# Altium project Ultimaker.PrjPcb (part 2 of 2)

## Sheet schema4.SchDoc
size A3; ApprovedBy: CdB; CheckedBy: CdB; DrawnBy: RT; Engineer: CdB; Organization: Faber Electronics B.V.; Address1: Th. Dobbeweg 1,; Address2: 6883 GN Velp,; Address3: Netherlands; Address4: T: 026-38 46 800; DocumentNumber: 4; Revision: 2.1.4; SheetNumber: 4; SheetTotal: 6; Status: Final; PageSetup: Record=PageOptions|CenterHorizontal=True|CenterVertical=True|PrintScale=1.01|XCorrection=1.00|YCorrection=1.00|PrintKind=1|BorderSize=5000000|LeftOffset=0|BottomOffset=0|Orientation=2|PaperLength=1000|PaperWidth=1000|Scale=100|PaperSource=7|PrintQuality=1200|MediaType=1|DitherType=10|PaperKind=A3 (297 x 420mm)|PrintScaleMode=1
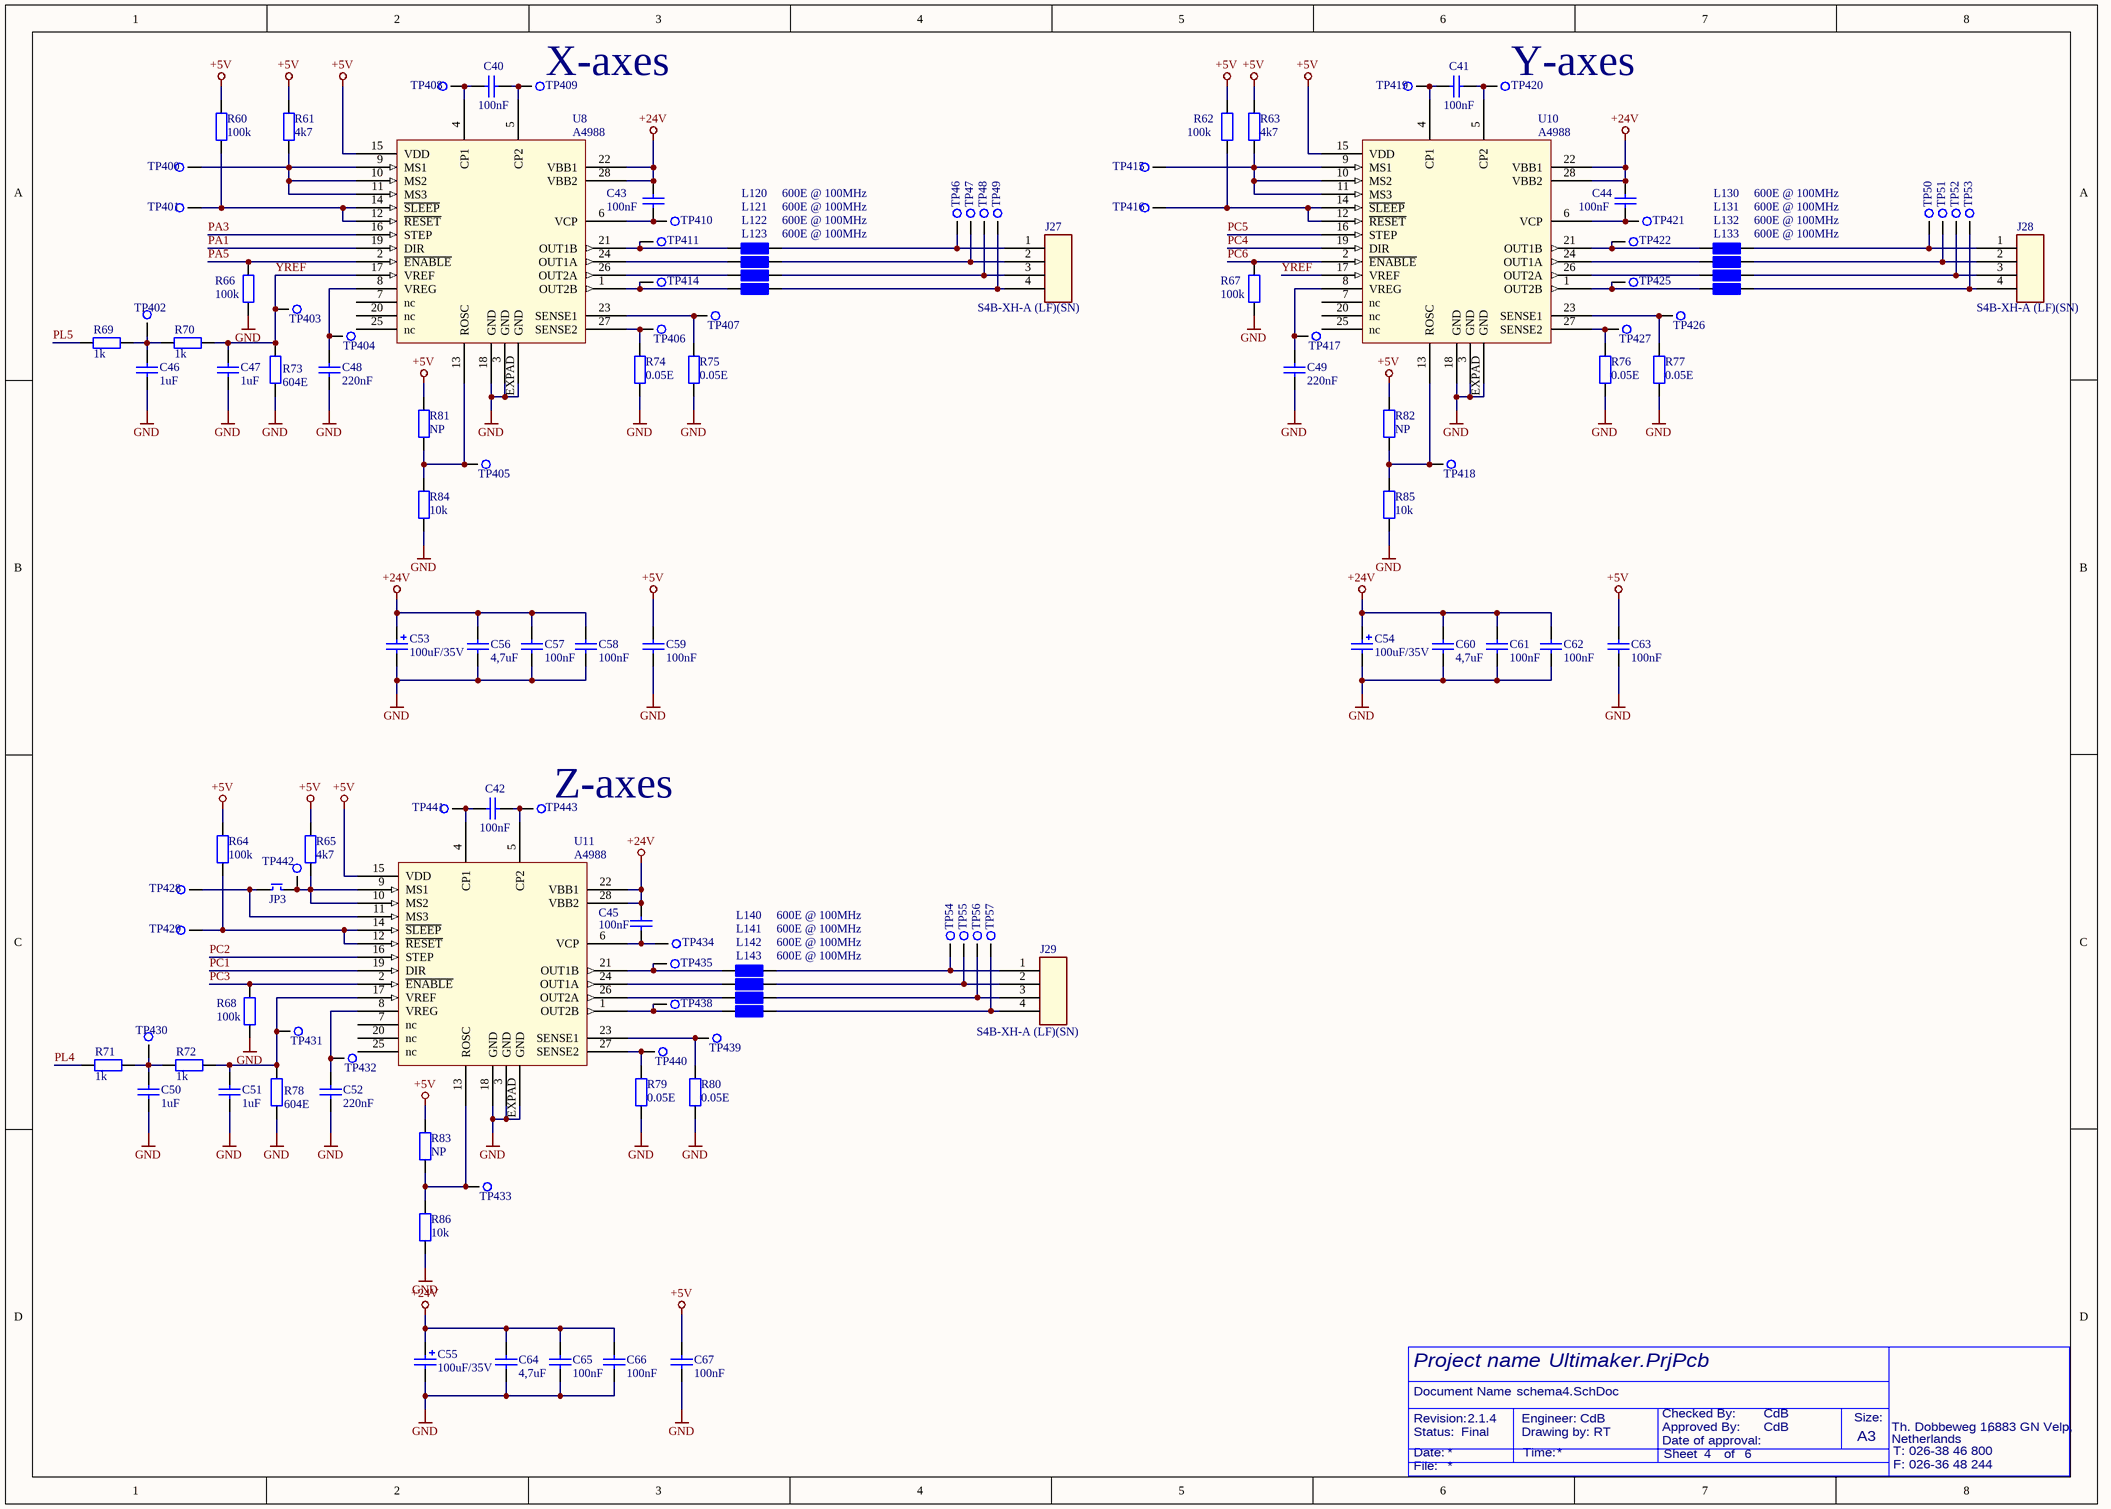
[diagram p4: schema4.SchDoc]

### Parts
C40  100nF  [C0603]
C41  100nF  [C0603]
C42  100nF  [C0603]
C43  100nF  [C0603]
C44  100nF  [C0603]
C45  100nF  [C0603]
C46  1uF  [C0603]
C47  1uF  [C0603]
C48  220nF  [C0603]
C49  220nF  [C0603]
C50  1uF  [C0603]
C51  1uF  [C0603]
C52  220nF  [C0603]
C53  100uF/35V  [ELCO Case D]
C54  100uF/35V  [ELCO Case D]
C55  100uF/35V  [ELCO Case D]
C56  4,7uF  [C1206]
C57  100nF  [C0603]
C58  100nF  [C0603]
C59  100nF  [C0603]
C60  4,7uF  [C1206]
C61  100nF  [C0603]
C62  100nF  [C0603]
C63  100nF  [C0603]
C64  4,7uF  [C1206]
C65  100nF  [C0603]
C66  100nF  [C0603]
C67  100nF  [C0603]
J27  S4B-XH-A (LF)(SN)  [S4B-XH-A (LF)(SN)]
J28  S4B-XH-A (LF)(SN)  [S4B-XH-A (LF)(SN)]
J29  S4B-XH-A (LF)(SN)  [S4B-XH-A (LF)(SN)]
JP3  HEADER 2  [HEADER-1x2P-ST-2.54]  (value not drawn)
L120  600E @ 100MHz  [R1206]
L121  600E @ 100MHz  [R1206]
L122  600E @ 100MHz  [R1206]
L123  600E @ 100MHz  [R1206]
L130  600E @ 100MHz  [R1206]
L131  600E @ 100MHz  [R1206]
L132  600E @ 100MHz  [R1206]
L133  600E @ 100MHz  [R1206]
L140  600E @ 100MHz  [R1206]
L141  600E @ 100MHz  [R1206]
L142  600E @ 100MHz  [R1206]
L143  600E @ 100MHz  [R1206]
R60  100k  [R0603]
R61  4k7  [R0603]
R62  100k  [R0603]
R63  4k7  [R0603]
R64  100k  [R0603]
R65  4k7  [R0603]
R66  100k  [R0603]
R67  100k  [R0603]
R68  100k  [R0603]
R69  1k  [R0603]
R70  1k  [R0603]
R71  1k  [R0603]
R72  1k  [R0603]
R73  604E  [R0603]
R74  0.05E  [R0805]
R75  0.05E  [R0805]
R76  0.05E  [R0805]
R77  0.05E  [R0805]
R78  604E  [R0603]
R79  0.05E  [R0805]
R80  0.05E  [R0805]
R81  NP  [R0603]
R82  NP  [R0603]
R83  NP  [R0603]
R84  10k  [R0603]
R85  10k  [R0603]
R86  10k  [R0603]
TP46  Testpoint  [Testpoint]  (value not drawn)
TP47  Testpoint  [Testpoint]  (value not drawn)
TP48  Testpoint  [Testpoint]  (value not drawn)
TP49  Testpoint  [Testpoint]  (value not drawn)
TP50  Testpoint  [Testpoint]  (value not drawn)
TP51  Testpoint  [Testpoint]  (value not drawn)
TP52  Testpoint  [Testpoint]  (value not drawn)
TP53  Testpoint  [Testpoint]  (value not drawn)
TP54  Testpoint  [Testpoint]  (value not drawn)
TP55  Testpoint  [Testpoint]  (value not drawn)
TP56  Testpoint  [Testpoint]  (value not drawn)
TP57  Testpoint  [Testpoint]  (value not drawn)
TP400  Testpoint 1mm  [Testpoint 1mm]  (value not drawn)
TP401  Testpoint 1mm  [Testpoint 1mm]  (value not drawn)
TP402  Testpoint 1mm  [Testpoint 1mm]  (value not drawn)
TP403  Testpoint 1mm  [Testpoint 1mm]  (value not drawn)
TP404  Testpoint 1mm  [Testpoint 1mm]  (value not drawn)
TP405  Testpoint 1mm  [Testpoint 1mm]  (value not drawn)
TP406  Testpoint 1mm  [Testpoint 1mm]  (value not drawn)
TP407  Testpoint 1mm  [Testpoint 1mm]  (value not drawn)
TP408  Testpoint 1mm  [Testpoint 1mm]  (value not drawn)
TP409  Testpoint 1mm  [Testpoint 1mm]  (value not drawn)
TP410  Testpoint 1mm  [Testpoint 1mm]  (value not drawn)
TP411  Testpoint 1mm  [Testpoint 1mm]  (value not drawn)
TP414  Testpoint 1mm  [Testpoint 1mm]  (value not drawn)
TP415  Testpoint 1mm  [Testpoint 1mm]  (value not drawn)
TP416  Testpoint 1mm  [Testpoint 1mm]  (value not drawn)
TP417  Testpoint 1mm  [Testpoint 1mm]  (value not drawn)
TP418  Testpoint 1mm  [Testpoint 1mm]  (value not drawn)
TP419  Testpoint 1mm  [Testpoint 1mm]  (value not drawn)
TP420  Testpoint 1mm  [Testpoint 1mm]  (value not drawn)
TP421  Testpoint 1mm  [Testpoint 1mm]  (value not drawn)
TP422  Testpoint 1mm  [Testpoint 1mm]  (value not drawn)
TP425  Testpoint 1mm  [Testpoint 1mm]  (value not drawn)
TP426  Testpoint 1mm  [Testpoint 1mm]  (value not drawn)
TP427  Testpoint 1mm  [Testpoint 1mm]  (value not drawn)
TP428  Testpoint 1mm  [Testpoint 1mm]  (value not drawn)
TP429  Testpoint 1mm  [Testpoint 1mm]  (value not drawn)
TP430  Testpoint 1mm  [Testpoint 1mm]  (value not drawn)
TP431  Testpoint 1mm  [Testpoint 1mm]  (value not drawn)
TP432  Testpoint 1mm  [Testpoint 1mm]  (value not drawn)
TP433  Testpoint 1mm  [Testpoint 1mm]  (value not drawn)
TP434  Testpoint 1mm  [Testpoint 1mm]  (value not drawn)
TP435  Testpoint 1mm  [Testpoint 1mm]  (value not drawn)
TP438  Testpoint 1mm  [Testpoint 1mm]  (value not drawn)
TP439  Testpoint 1mm  [Testpoint 1mm]  (value not drawn)
TP440  Testpoint 1mm  [Testpoint 1mm]  (value not drawn)
TP441  Testpoint 1mm  [Testpoint 1mm]  (value not drawn)
TP442  Testpoint 1mm  [Testpoint 1mm]  (value not drawn)
TP443  Testpoint 1mm  [Testpoint 1mm]  (value not drawn)
U8  A4988  [QFN50P500X500X100-28-EX]
U10  A4988  [QFN50P500X500X100-28-EX]
U11  A4988  [QFN50P500X500X100-28-EX]

### Nets
+5V: C59.2 C63.2 C67.2 R60.2 R61.2 R62.2 R63.2 R64.2 R65.2 R81.2 R82.2 R83.2 U8.15(VDD) U10.15(VDD) U11.15(VDD)
+24V: C43.2 C44.2 C45.2 C53.1 C54.1 C55.1 C56.2 C57.2 C58.2 C60.2 C61.2 C62.2 C64.2 C65.2 C66.2 U8.22(VBB1) U8.28(VBB2) U10.22(VBB1) U10.28(VBB2) U11.22(VBB1) U11.28(VBB2)
GND: C46.1 C47.1 C48.1 C49.1 C50.1 C51.1 C52.1 C53.2 C54.2 C55.2 C56.1 C57.1 C58.1 C59.1 C60.1 C61.1 C62.1 C63.1 C64.1 C65.1 C66.1 C67.1 R66.2 R67.2 R68.2 R73.1 R74.1 R75.1 R76.1 R77.1 R78.1 R79.1 R80.1 R84.1 R85.1 R86.1 U8.3(GND) U8.18(GND) U8.EXPAD(GND) U10.3(GND) U10.18(GND) U10.EXPAD(GND) U11.3(GND) U11.18(GND) U11.EXPAD(GND)
PA1: U8.19(DIR)
PA3: U8.16(STEP)
PA5: R66.1 U8.2(~{ENABLE})
PC1: U11.19(DIR)
PC2: U11.16(STEP)
PC3: R68.1 U11.2(~{ENABLE})
PC4: U10.19(DIR)
PC5: U10.16(STEP)
PC6: R67.1 U10.2(~{ENABLE})
PL4: R71.1
PL5: R69.1
YREF: C47.2 R70.2 R73.2 TP403.1 U8.17(VREF) U10.17(VREF)
NetC40_1: C40.1 TP408.1 U8.4(CP1)
NetC40_2: C40.2 TP409.1 U8.5(CP2)
NetC41_1: C41.1 TP419.1 U10.4(CP1)
NetC41_2: C41.2 TP420.1 U10.5(CP2)
NetC42_1: C42.1 TP441.1 U11.4(CP1)
NetC42_2: C42.2 TP443.1 U11.5(CP2)
NetC43_1: C43.1 TP410.1 U8.6(VCP)
NetC44_1: C44.1 TP421.1 U10.6(VCP)
NetC45_1: C45.1 TP434.1 U11.6(VCP)
NetC46_2: C46.2 R69.2 R70.1 TP402.1
NetC48_2: C48.2 TP404.1 U8.8(VREG)
NetC49_2: C49.2 TP417.1 U10.8(VREG)
NetC50_2: C50.2 R71.2 R72.1 TP430.1
NetC51_2: C51.2 R72.2 R78.2 TP431.1 U11.17(VREF)
NetC52_2: C52.2 TP432.1 U11.8(VREG)
NetJ27_1: J27.1 L120.2 TP46.1
NetJ27_2: J27.2 L121.2 TP47.1
NetJ27_3: J27.3 L122.2 TP48.1
NetJ27_4: J27.4 L123.2 TP49.1
NetJ28_1: J28.1 L130.2 TP50.1
NetJ28_2: J28.2 L131.2 TP51.1
NetJ28_3: J28.3 L132.2 TP52.1
NetJ28_4: J28.4 L133.2 TP53.1
NetJ29_1: J29.1 L140.2 TP54.1
NetJ29_2: J29.2 L141.2 TP55.1
NetJ29_3: J29.3 L142.2 TP56.1
NetJ29_4: J29.4 L143.2 TP57.1
NetJP3_1: JP3.1 TP428.1 U11.11(MS3)
NetJP3_2: JP3.2 R65.1 TP442.1 U11.9(MS1) U11.10(MS2)
NetL120_1: L120.1 TP411.1 U8.21(OUT1B)
NetL121_1: L121.1 U8.24(OUT1A)
NetL122_1: L122.1 U8.26(OUT2A)
NetL123_1: L123.1 TP414.1 U8.1(OUT2B)
NetL130_1: L130.1 TP422.1 U10.21(OUT1B)
NetL131_1: L131.1 U10.24(OUT1A)
NetL132_1: L132.1 U10.26(OUT2A)
NetL133_1: L133.1 TP425.1 U10.1(OUT2B)
NetL140_1: L140.1 TP435.1 U11.21(OUT1B)
NetL141_1: L141.1 U11.24(OUT1A)
NetL142_1: L142.1 U11.26(OUT2A)
NetL143_1: L143.1 TP438.1 U11.1(OUT2B)
NetR60_1: R60.1 TP401.1 U8.12(~{RESET}) U8.14(~{SLEEP})
NetR61_1: R61.1 TP400.1 U8.9(MS1) U8.10(MS2) U8.11(MS3)
NetR62_1: R62.1 TP416.1 U10.12(~{RESET}) U10.14(~{SLEEP})
NetR63_1: R63.1 TP415.1 U10.9(MS1) U10.10(MS2) U10.11(MS3)
NetR64_1: R64.1 TP429.1 U11.12(~{RESET}) U11.14(~{SLEEP})
NetR74_2: R74.2 TP406.1 U8.27(SENSE2)
NetR75_2: R75.2 TP407.1 U8.23(SENSE1)
NetR76_2: R76.2 TP427.1 U10.27(SENSE2)
NetR77_2: R77.2 TP426.1 U10.23(SENSE1)
NetR79_2: R79.2 TP440.1 U11.27(SENSE2)
NetR80_2: R80.2 TP439.1 U11.23(SENSE1)
NetR81_1: R81.1 R84.2 TP405.1 U8.13(ROSC)
NetR82_1: R82.1 R85.2 TP418.1 U10.13(ROSC)
NetR83_1: R83.1 R86.2 TP433.1 U11.13(ROSC)

Not connected (* = marked no-connect by the designer): U8 7(nc) 20(nc) 25(nc); U10 7(nc) 20(nc) 25(nc); U11 7(nc) 20(nc) 25(nc)

### Notes on the sheet
- (near TP409) X-axes
- (near TP420) Y-axes
- (near TP443) Z-axes
- Project name
- Document Name
- Revision:
- Date:
- Status:
- Engineer:
- Drawing by:
- Time:
- Approved By:
- Checked By:
- Date of approval:
- Sheet
- of
- Size:
- A3
- File:
- F: 026-36 48 244

### Library data of the parts
C40-C45 C57-C59 C61-C63 C65-C67 = Library_CAP-0002: as C2 on sheet schema1; ID: Library_CAP-0002; Value: 100nF
C46 C47 C50 C51 = Library_CAP-0006: as C6 on sheet schema1; ID: Library_CAP-0006; Value: 1uF
C48 C49 C52 = Library_CAP-0001: RO X7R 220nF 10% 25V  0603; Faber ItemCode: 36126300; ID: Library_CAP-0001; Value: 220nF
C53-C55 = Library_CAP-0004: as C36 on sheet schema3; ID: Library_CAP-0004; Value: 100uF/35V
C56 C60 C64 = Library_CAP-0003: RO X7R 4,7uF 10% 50V 1206; Faber ItemCode: 35404600; ID: Library_CAP-0003; Value: 4,7uF
J27-J29 = Library_CON-0005: RO CONN PR 4p HKS S4B-XH-A (LF)(SN) JST; Mfg: JST (JAPAN SOLDERLESS TERMINALS); Faber ItemCode: 36926500; ID: Library_CON-0005; Mfg code: S4B-XH-A (LF)(SN); Value: S4B-XH-A (LF)(SN)
JP3 = Library_CON-0018: HEADER-1x2P-ST-2.54; ID: Library_CON-0018; Value: HEADER 2
L120-L123 L130-L133 L140-L143 = Ferriet Bead 600E: FERRIET 742792118 1206 Wurth Elektronik; Mfg: Wurth Elektronics; Mfg code: 1800374; ID: -; Faber ItemCode: -; Info: Ferriet; Value: 600E @ 100MHz
R60 R62 R64 R66-R68 = Library_RES-0005: as R49 on sheet schema3; ID: Library_RES-0005; Info: Resistor; Value: 100k
R61 R63 R65 = Library_RES-0002: as R16 on sheet schema2; ID: Library_RES-0002; Info: Resistor; Value: 4k7
R69-R72 = Library_RES-0004: as R11 on sheet schema1; ID: Library_RES-0004; Info: Resistor; Value: 1k
R73 R78 = Library_RES-0018: RO RES 604E 1% 0,063W 0603; Mfg: VISHAY DRALORIC; Mfg code: CRCW0603604RFKEA; Faber ItemCode: 36932600; ID: Library_RES-0018; Info: Resistor; Value: 604E
R74-R77 R79 R80 = Library_RES-0013: RO RES 0E05 1% 0,125W 0805; Mfg: BOURNS; Mfg code: CRL0805-FW-R050ELF; Faber ItemCode: 36925700; ID: Library_RES-0013; Info: Resistor; Value: 0.05E
R81-R83 = Library_RES-0001
R84-R86 = Library_RES-0001: as R1 on sheet schema1; ID: Library_RES-0001; Info: Resistor; Value: 10k
TP46-TP57 = Library_MISC-0001: Info: Testpoint, 2mm, round; ID: Library_MISC-0001; Faber ItemCode: -; Mfg: -; Mfg code: -; Value: Testpoint
TP400-TP411 TP414-TP422 TP425-TP435 TP438-TP443 = Testpoint 1mm: ID: Library_MISC-0001; Faber ItemCode: -; Mfg: -; Mfg code: -; Info: Testpoint 1mm; Value: Testpoint 1mm
U8 U10 U11 = Library_ICS-0002: RO IC A4988 QFN-28 ALLEGRO; Mfg code: A4988SETTR-T; Info: DMOS Microstepping Driver with Translator and Overcurrent Protection; Faber ItemCode: 36921600; ID: Library_ICS-0002; Mfg: Allegro; Value: A4988

## Sheet schema5.SchDoc
size A3; ApprovedBy: CdB; CheckedBy: CdB; DrawnBy: RT; Engineer: CdB; Organization: Faber Electronics B.V.; Address1: Th. Dobbeweg 1,; Address2: 6883 GN Velp,; Address3: Netherlands; Address4: T: 026-38 46 800; DocumentNumber: 5; Revision: 2.1.4; SheetNumber: 5; SheetTotal: 6; Status: Final; PageSetup: Record=PageOptions|CenterHorizontal=True|CenterVertical=True|PrintScale=1.01|XCorrection=1.00|YCorrection=1.00|PrintKind=1|BorderSize=5000000|LeftOffset=0|BottomOffset=0|Orientation=2|PaperLength=1000|PaperWidth=1000|Scale=100|PaperSource=7|PrintQuality=1200|MediaType=1|DitherType=10|PaperKind=A3 (297 x 420mm)|PrintScaleMode=1
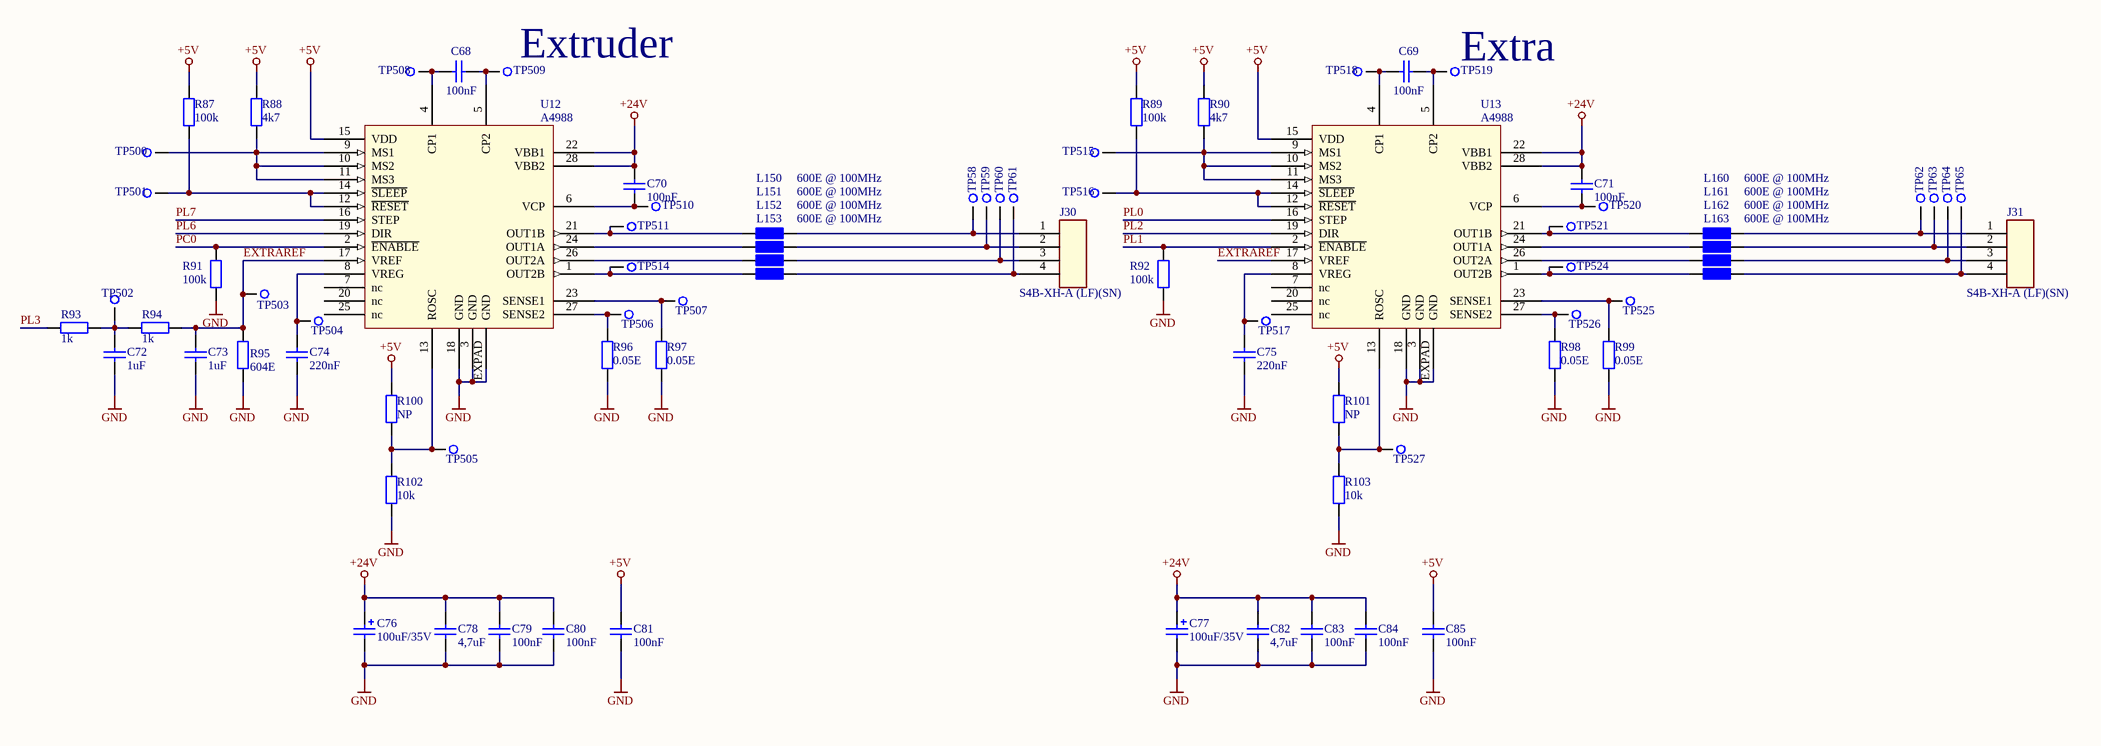
[diagram p5: schema5.SchDoc]

### Parts
C68  100nF  [C0603]
C69  100nF  [C0603]
C70  100nF  [C0603]
C71  100nF  [C0603]
C72  1uF  [C0603]
C73  1uF  [C0603]
C74  220nF  [C0603]
C75  220nF  [C0603]
C76  100uF/35V  [ELCO Case D]
C77  100uF/35V  [ELCO Case D]
C78  4,7uF  [C1206]
C79  100nF  [C0603]
C80  100nF  [C0603]
C81  100nF  [C0603]
C82  4,7uF  [C1206]
C83  100nF  [C0603]
C84  100nF  [C0603]
C85  100nF  [C0603]
J30  S4B-XH-A (LF)(SN)  [S4B-XH-A (LF)(SN)]
J31  S4B-XH-A (LF)(SN)  [S4B-XH-A (LF)(SN)]
L150  600E @ 100MHz  [R1206]
L151  600E @ 100MHz  [R1206]
L152  600E @ 100MHz  [R1206]
L153  600E @ 100MHz  [R1206]
L160  600E @ 100MHz  [R1206]
L161  600E @ 100MHz  [R1206]
L162  600E @ 100MHz  [R1206]
L163  600E @ 100MHz  [R1206]
R87  100k  [R0603]
R88  4k7  [R0603]
R89  100k  [R0603]
R90  4k7  [R0603]
R91  100k  [R0603]
R92  100k  [R0603]
R93  1k  [R0603]
R94  1k  [R0603]
R95  604E  [R0603]
R96  0.05E  [R0805]
R97  0.05E  [R0805]
R98  0.05E  [R0805]
R99  0.05E  [R0805]
R100  NP  [R0603]
R101  NP  [R0603]
R102  10k  [R0603]
R103  10k  [R0603]
TP58  Testpoint  [Testpoint]  (value not drawn)
TP59  Testpoint  [Testpoint]  (value not drawn)
TP60  Testpoint  [Testpoint]  (value not drawn)
TP61  Testpoint  [Testpoint]  (value not drawn)
TP62  Testpoint  [Testpoint]  (value not drawn)
TP63  Testpoint  [Testpoint]  (value not drawn)
TP64  Testpoint  [Testpoint]  (value not drawn)
TP65  Testpoint  [Testpoint]  (value not drawn)
TP500  Testpoint 1mm  [Testpoint 1mm]  (value not drawn)
TP501  Testpoint 1mm  [Testpoint 1mm]  (value not drawn)
TP502  Testpoint 1mm  [Testpoint 1mm]  (value not drawn)
TP503  Testpoint 1mm  [Testpoint 1mm]  (value not drawn)
TP504  Testpoint 1mm  [Testpoint 1mm]  (value not drawn)
TP505  Testpoint 1mm  [Testpoint 1mm]  (value not drawn)
TP506  Testpoint 1mm  [Testpoint 1mm]  (value not drawn)
TP507  Testpoint 1mm  [Testpoint 1mm]  (value not drawn)
TP508  Testpoint 1mm  [Testpoint 1mm]  (value not drawn)
TP509  Testpoint 1mm  [Testpoint 1mm]  (value not drawn)
TP510  Testpoint 1mm  [Testpoint 1mm]  (value not drawn)
TP511  Testpoint 1mm  [Testpoint 1mm]  (value not drawn)
TP514  Testpoint 1mm  [Testpoint 1mm]  (value not drawn)
TP515  Testpoint 1mm  [Testpoint 1mm]  (value not drawn)
TP516  Testpoint 1mm  [Testpoint 1mm]  (value not drawn)
TP517  Testpoint 1mm  [Testpoint 1mm]  (value not drawn)
TP518  Testpoint 1mm  [Testpoint 1mm]  (value not drawn)
TP519  Testpoint 1mm  [Testpoint 1mm]  (value not drawn)
TP520  Testpoint 1mm  [Testpoint 1mm]  (value not drawn)
TP521  Testpoint 1mm  [Testpoint 1mm]  (value not drawn)
TP524  Testpoint 1mm  [Testpoint 1mm]  (value not drawn)
TP525  Testpoint 1mm  [Testpoint 1mm]  (value not drawn)
TP526  Testpoint 1mm  [Testpoint 1mm]  (value not drawn)
TP527  Testpoint 1mm  [Testpoint 1mm]  (value not drawn)
U12  A4988  [QFN50P500X500X100-28-EX]
U13  A4988  [QFN50P500X500X100-28-EX]

### Nets
+5V: C81.2 C85.2 R87.2 R88.2 R89.2 R90.2 R100.2 R101.2 U12.15(VDD) U13.15(VDD)
+24V: C70.2 C71.2 C76.1 C77.1 C78.2 C79.2 C80.2 C82.2 C83.2 C84.2 U12.22(VBB1) U12.28(VBB2) U13.22(VBB1) U13.28(VBB2)
GND: C72.1 C73.1 C74.1 C75.1 C76.2 C77.2 C78.1 C79.1 C80.1 C81.1 C82.1 C83.1 C84.1 C85.1 R91.2 R92.2 R95.1 R96.1 R97.1 R98.1 R99.1 R102.1 R103.1 U12.3(GND) U12.18(GND) U12.EXPAD(GND) U13.3(GND) U13.18(GND) U13.EXPAD(GND)
EXTRAREF: C73.2 R94.2 R95.2 TP503.1 U12.17(VREF) U13.17(VREF)
PC0: R91.1 U12.2(~{ENABLE})
PL0: U13.16(STEP)
PL1: R92.1 U13.2(~{ENABLE})
PL2: U13.19(DIR)
PL3: R93.1
PL6: U12.19(DIR)
PL7: U12.16(STEP)
NetC68_1: C68.1 TP508.1 U12.4(CP1)
NetC68_2: C68.2 TP509.1 U12.5(CP2)
NetC69_1: C69.1 TP518.1 U13.4(CP1)
NetC69_2: C69.2 TP519.1 U13.5(CP2)
NetC70_1: C70.1 TP510.1 U12.6(VCP)
NetC71_1: C71.1 TP520.1 U13.6(VCP)
NetC72_2: C72.2 R93.2 R94.1 TP502.1
NetC74_2: C74.2 TP504.1 U12.8(VREG)
NetC75_2: C75.2 TP517.1 U13.8(VREG)
NetJ30_1: J30.1 L150.2 TP58.1
NetJ30_2: J30.2 L151.2 TP59.1
NetJ30_3: J30.3 L152.2 TP60.1
NetJ30_4: J30.4 L153.2 TP61.1
NetJ31_1: J31.1 L160.2 TP62.1
NetJ31_2: J31.2 L161.2 TP63.1
NetJ31_3: J31.3 L162.2 TP64.1
NetJ31_4: J31.4 L163.2 TP65.1
NetL150_1: L150.1 TP511.1 U12.21(OUT1B)
NetL151_1: L151.1 U12.24(OUT1A)
NetL152_1: L152.1 U12.26(OUT2A)
NetL153_1: L153.1 TP514.1 U12.1(OUT2B)
NetL160_1: L160.1 TP521.1 U13.21(OUT1B)
NetL161_1: L161.1 U13.24(OUT1A)
NetL162_1: L162.1 U13.26(OUT2A)
NetL163_1: L163.1 TP524.1 U13.1(OUT2B)
NetR87_1: R87.1 TP501.1 U12.12(~{RESET}) U12.14(~{SLEEP})
NetR88_1: R88.1 TP500.1 U12.9(MS1) U12.10(MS2) U12.11(MS3)
NetR89_1: R89.1 TP516.1 U13.12(~{RESET}) U13.14(~{SLEEP})
NetR90_1: R90.1 TP515.1 U13.9(MS1) U13.10(MS2) U13.11(MS3)
NetR96_2: R96.2 TP506.1 U12.27(SENSE2)
NetR97_2: R97.2 TP507.1 U12.23(SENSE1)
NetR98_2: R98.2 TP526.1 U13.27(SENSE2)
NetR99_2: R99.2 TP525.1 U13.23(SENSE1)
NetR100_1: R100.1 R102.2 TP505.1 U12.13(ROSC)
NetR101_1: R101.1 R103.2 TP527.1 U13.13(ROSC)

Not connected (* = marked no-connect by the designer): U12 7(nc) 20(nc) 25(nc); U13 7(nc) 20(nc) 25(nc)

### Notes on the sheet
- (near TP509) Extruder
- (near TP519) Extra
- Project name
- Document Name
- Revision:
- Date:
- Status:
- Engineer:
- Drawing by:
- Time:
- Approved By:
- Checked By:
- Date of approval:
- Sheet
- of
- Size:
- A3
- File:
- F: 026-36 48 244

### Library data of the parts
C68-C71 C79-C81 C83-C85 = Library_CAP-0002: RO X7R 100nF 10% 50V 0603; Faber ItemCode: 45068500; ID: Library_CAP-0002; Value: 100nF
C72 C73 = Library_CAP-0006: RO X5R 1uF 10% 10V 0603; Faber ItemCode: 36310600; ID: Library_CAP-0006; Value: 1uF
C74 C75 = Library_CAP-0001: RO X7R 220nF 10% 25V  0603; Faber ItemCode: 36126300; ID: Library_CAP-0001; Value: 220nF
C76 C77 = Library_CAP-0004: RO ELCO 100uF 20% 35V CASE-D EEEFP PAN; Faber ItemCode: 36865800; ID: Library_CAP-0004; Value: 100uF/35V
C78 C82 = Library_CAP-0003: RO X7R 4,7uF 10% 50V 1206; Faber ItemCode: 35404600; ID: Library_CAP-0003; Value: 4,7uF
J30 J31 = Library_CON-0005: RO CONN PR 4p HKS S4B-XH-A (LF)(SN) JST; Mfg: JST (JAPAN SOLDERLESS TERMINALS); Faber ItemCode: 36926500; ID: Library_CON-0005; Mfg code: S4B-XH-A (LF)(SN); Value: S4B-XH-A (LF)(SN)
L150-L153 L160-L163 = Ferriet Bead 600E: FERRIET 742792118 1206 Wurth Elektronik; Mfg: Wurth Elektronics; Mfg code: 1800374; ID: -; Faber ItemCode: -; Info: Ferriet; Value: 600E @ 100MHz
R87 R89 R91 R92 = Library_RES-0005: RO RES 100k0 1% 0,063W  0603; Faber ItemCode: 36257800; ID: Library_RES-0005; Info: Resistor; Value: 100k
R88 R90 = Library_RES-0002: RO RES 4k70 1% 0,063W  0603; Faber ItemCode: 36257400; ID: Library_RES-0002; Info: Resistor; Value: 4k7
R93 R94 = Library_RES-0004: RO RES 1k0 1% 0,1W  0603; Faber ItemCode: 34637900; ID: Library_RES-0004; Info: Resistor; Value: 1k
R95 = Library_RES-0018: RO RES 604E 1% 0,063W 0603; Mfg: VISHAY DRALORIC; Mfg code: CRCW0603604RFKEA; Faber ItemCode: 36932600; ID: Library_RES-0018; Info: Resistor; Value: 604E
R96-R99 = Library_RES-0013: RO RES 0E05 1% 0,125W 0805; Mfg: BOURNS; Mfg code: CRL0805-FW-R050ELF; Faber ItemCode: 36925700; ID: Library_RES-0013; Info: Resistor; Value: 0.05E
R100 R101 = Library_RES-0001
R102 R103 = Library_RES-0001: RO RES 10k0 1% 0,063W  0603; Faber ItemCode: 36084500; ID: Library_RES-0001; Info: Resistor; Value: 10k
TP58-TP65 = Library_MISC-0001: Info: Testpoint, 2mm, round; ID: Library_MISC-0001; Faber ItemCode: -; Mfg: -; Mfg code: -; Value: Testpoint
TP500-TP511 TP514-TP521 TP524-TP527 = Testpoint 1mm: ID: Library_MISC-0001; Faber ItemCode: -; Mfg: -; Mfg code: -; Info: Testpoint 1mm; Value: Testpoint 1mm
U12 U13 = Library_ICS-0002: RO IC A4988 QFN-28 ALLEGRO; Mfg code: A4988SETTR-T; Info: DMOS Microstepping Driver with Translator and Overcurrent Protection; Faber ItemCode: 36921600; ID: Library_ICS-0002; Mfg: Allegro; Value: A4988

## Nets that join several sheets
+5V: schema1 (22 pins), schema2 (13 pins), schema3 (29 pins), schema4 (15 pins), schema5 (10 pins)
+24V: schema3 (15 pins), schema4 (21 pins), schema5 (14 pins)
GND: schema1 (26 pins), schema2 (34 pins), schema3 (68 pins), schema4 (45 pins), schema5 (29 pins)
VCC/2: schema2 (6 pins), schema3 (5 pins)
ADC0: schema1 (TP132.1 U1.97), schema3 (J25.1)
ADC1: schema1 (TP133.1 U1.96), schema3 (J25.2)
ADC2: schema1 (TP134.1 U1.95), schema3 (J25.3)
ADC3: schema1 (TP135.1 U1.94), schema3 (J25.4)
ADC4: schema1 (TP136.1 U1.93), schema3 (J25.5)
ADC5: schema1 (TP137.1 U1.92), schema3 (J25.6)
ADC6: schema1 (TP138.1 U1.91), schema3 (J25.7)
ADC7: schema1 (TP139.1 U1.90), schema3 (J25.8)
ADC8: schema1 (TP140.1 U1.89), schema2 (C16.2 R21.2)
ADC9: schema1 (TP141.1 U1.88), schema2 (C23.2 R32.2)
ADC10: schema1 (TP142.1 U1.87), schema2 (C28.2 R39.2)
ADC11: schema1 (TP143.1 U1.86), schema3 (J24.3)
ADC12: schema1 (TP144.1 U1.85), schema3 (J24.4)
ADC13: schema1 (TP145.1 U1.84), schema3 (J24.5)
ADC14: schema1 (TP146.1 U1.83), schema3 (R49.1 R50.2)
ADC15: schema1 (TP147.1 U1.82), schema2 (C22.2 R30.2)
PA0: schema1 (TP148.1 U1.78), schema2 (C13.2 R18.2)
PA1: schema1 (TP149.1 U1.77), schema4 (U8.19)
PA3: schema1 (TP151.1 U1.75), schema4 (U8.16)
PA4: schema1 (TP152.1 U1.74), schema2 (C18.2 R26.2)
PA5: schema1 (TP153.1 U1.73), schema4 (R66.1 U8.2)
PA6: schema1 (TP154.1 U1.72), schema3 (R109.1 U7.3)
PA7: schema1 (TP155.1 U1.71), schema2 (C92.2 R111.2)
PB0: schema1 (U1.19), schema3 (J33.4 TP29.1)
PB1: schema1 (J1.3 TP3.1 U1.20), schema3 (J33.2 TP25.1)
PB2: schema1 (J1.4 TP2.1 U1.21), schema3 (J33.6 TP33.1)
PB3: schema1 (J1.1 TP4.1 U1.22), schema3 (J33.1 TP23.1)
PB7: schema1 (TP113.1 U1.26), schema3 (J26.3)
PC0: schema1 (TP166.1 U1.53), schema5 (R91.1 U12.2)
PC1: schema1 (TP165.1 U1.54), schema4 (U11.19)
PC2: schema1 (TP164.1 U1.55), schema4 (U11.16)
PC3: schema1 (TP163.1 U1.56), schema4 (R68.1 U11.2)
PC4: schema1 (TP162.1 U1.57), schema4 (U10.19)
PC5: schema1 (TP161.1 U1.58), schema4 (U10.16)
PC6: schema1 (TP160.1 U1.59), schema4 (R67.1 U10.2)
PC7: schema1 (TP159.1 U1.60), schema3 (J23.5)
PD7: schema1 (TP125.1 U1.50), schema3 (J23.6)
PE3: schema1 (U1.5), schema3 (J32.7 TP28.1)
PE4: schema1 (TP105.1 U1.6), schema3 (R56.1)
PE5: schema1 (TP106.1 U1.7), schema3 (R55.1)
PG0: schema1 (U1.51), schema3 (J33.3 TP27.1)
PG1: schema1 (U1.52), schema3 (J33.5 TP31.1)
PG2: schema1 (U1.70), schema3 (J33.7 TP35.1)
PG5: schema1 (TP126.1 U1.1), schema3 (R54.1)
PH3: schema1 (U1.15), schema3 (J32.8 TP26.1)
PH4: schema1 (TP110.1 U1.16), schema2 (R43.1)
PH5: schema1 (TP111.1 U1.17), schema2 (R44.1)
PJ6: schema1 (TP156.1 U1.69), schema3 (R120.1)
PL0: schema1 (TP114.1 U1.35), schema5 (U13.16)
PL1: schema1 (U1.36), schema5 (R92.1 U13.2)
PL2: schema1 (TP115.1 U1.37), schema5 (U13.19)
PL3: schema1 (TP116.1 U1.38), schema5 (R93.1)
PL4: schema1 (TP117.1 U1.39), schema4 (R71.1)
PL5: schema1 (TP118.1 U1.40), schema4 (R69.1)
PL6: schema1 (TP119.1 U1.41), schema5 (U12.19)
PL7: schema1 (TP120.1 U1.42), schema5 (U12.16)
RXD1: schema1 (U1.45), schema3 (J32.2 TP38.1)
RXD2: schema1 (TP107.1 U1.12), schema3 (J22.4)
RXD3: schema1 (U1.63), schema3 (J32.3 TP36.1)
SCL: schema1 (R2.2 U1.43), schema3 (J32.6 TP30.1)
SDA: schema1 (R1.2 U1.44), schema3 (J32.4 TP34.1)
TXD1: schema1 (U1.46), schema3 (J32.1 TP44.1)
TXD2: schema1 (TP108.1 U1.13), schema3 (J22.3)
TXD3: schema1 (U1.64), schema3 (J32.5 TP32.1)

## Assembly variants
Ultimaker (NP-componenten): not fitted R81 R82 R83 R100 R101